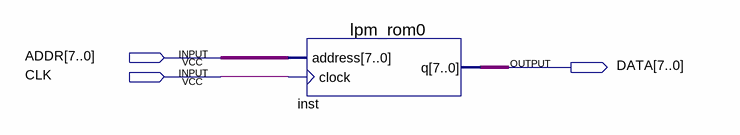
[diagram p0: schematic sheet]
// Quartus schematic rom.bdf as structural Verilog: 1 symbols, 3 pins
module rom (
  input  [7:0] ADDR,
  input  CLK,
  output [7:0] DATA
);

  lpm_rom0 inst (.address(ADDR), .clock(CLK), .q(DATA));
endmodule
